# EAGLE design rgb-vfd-matrix (EAGLE 7.7.0)
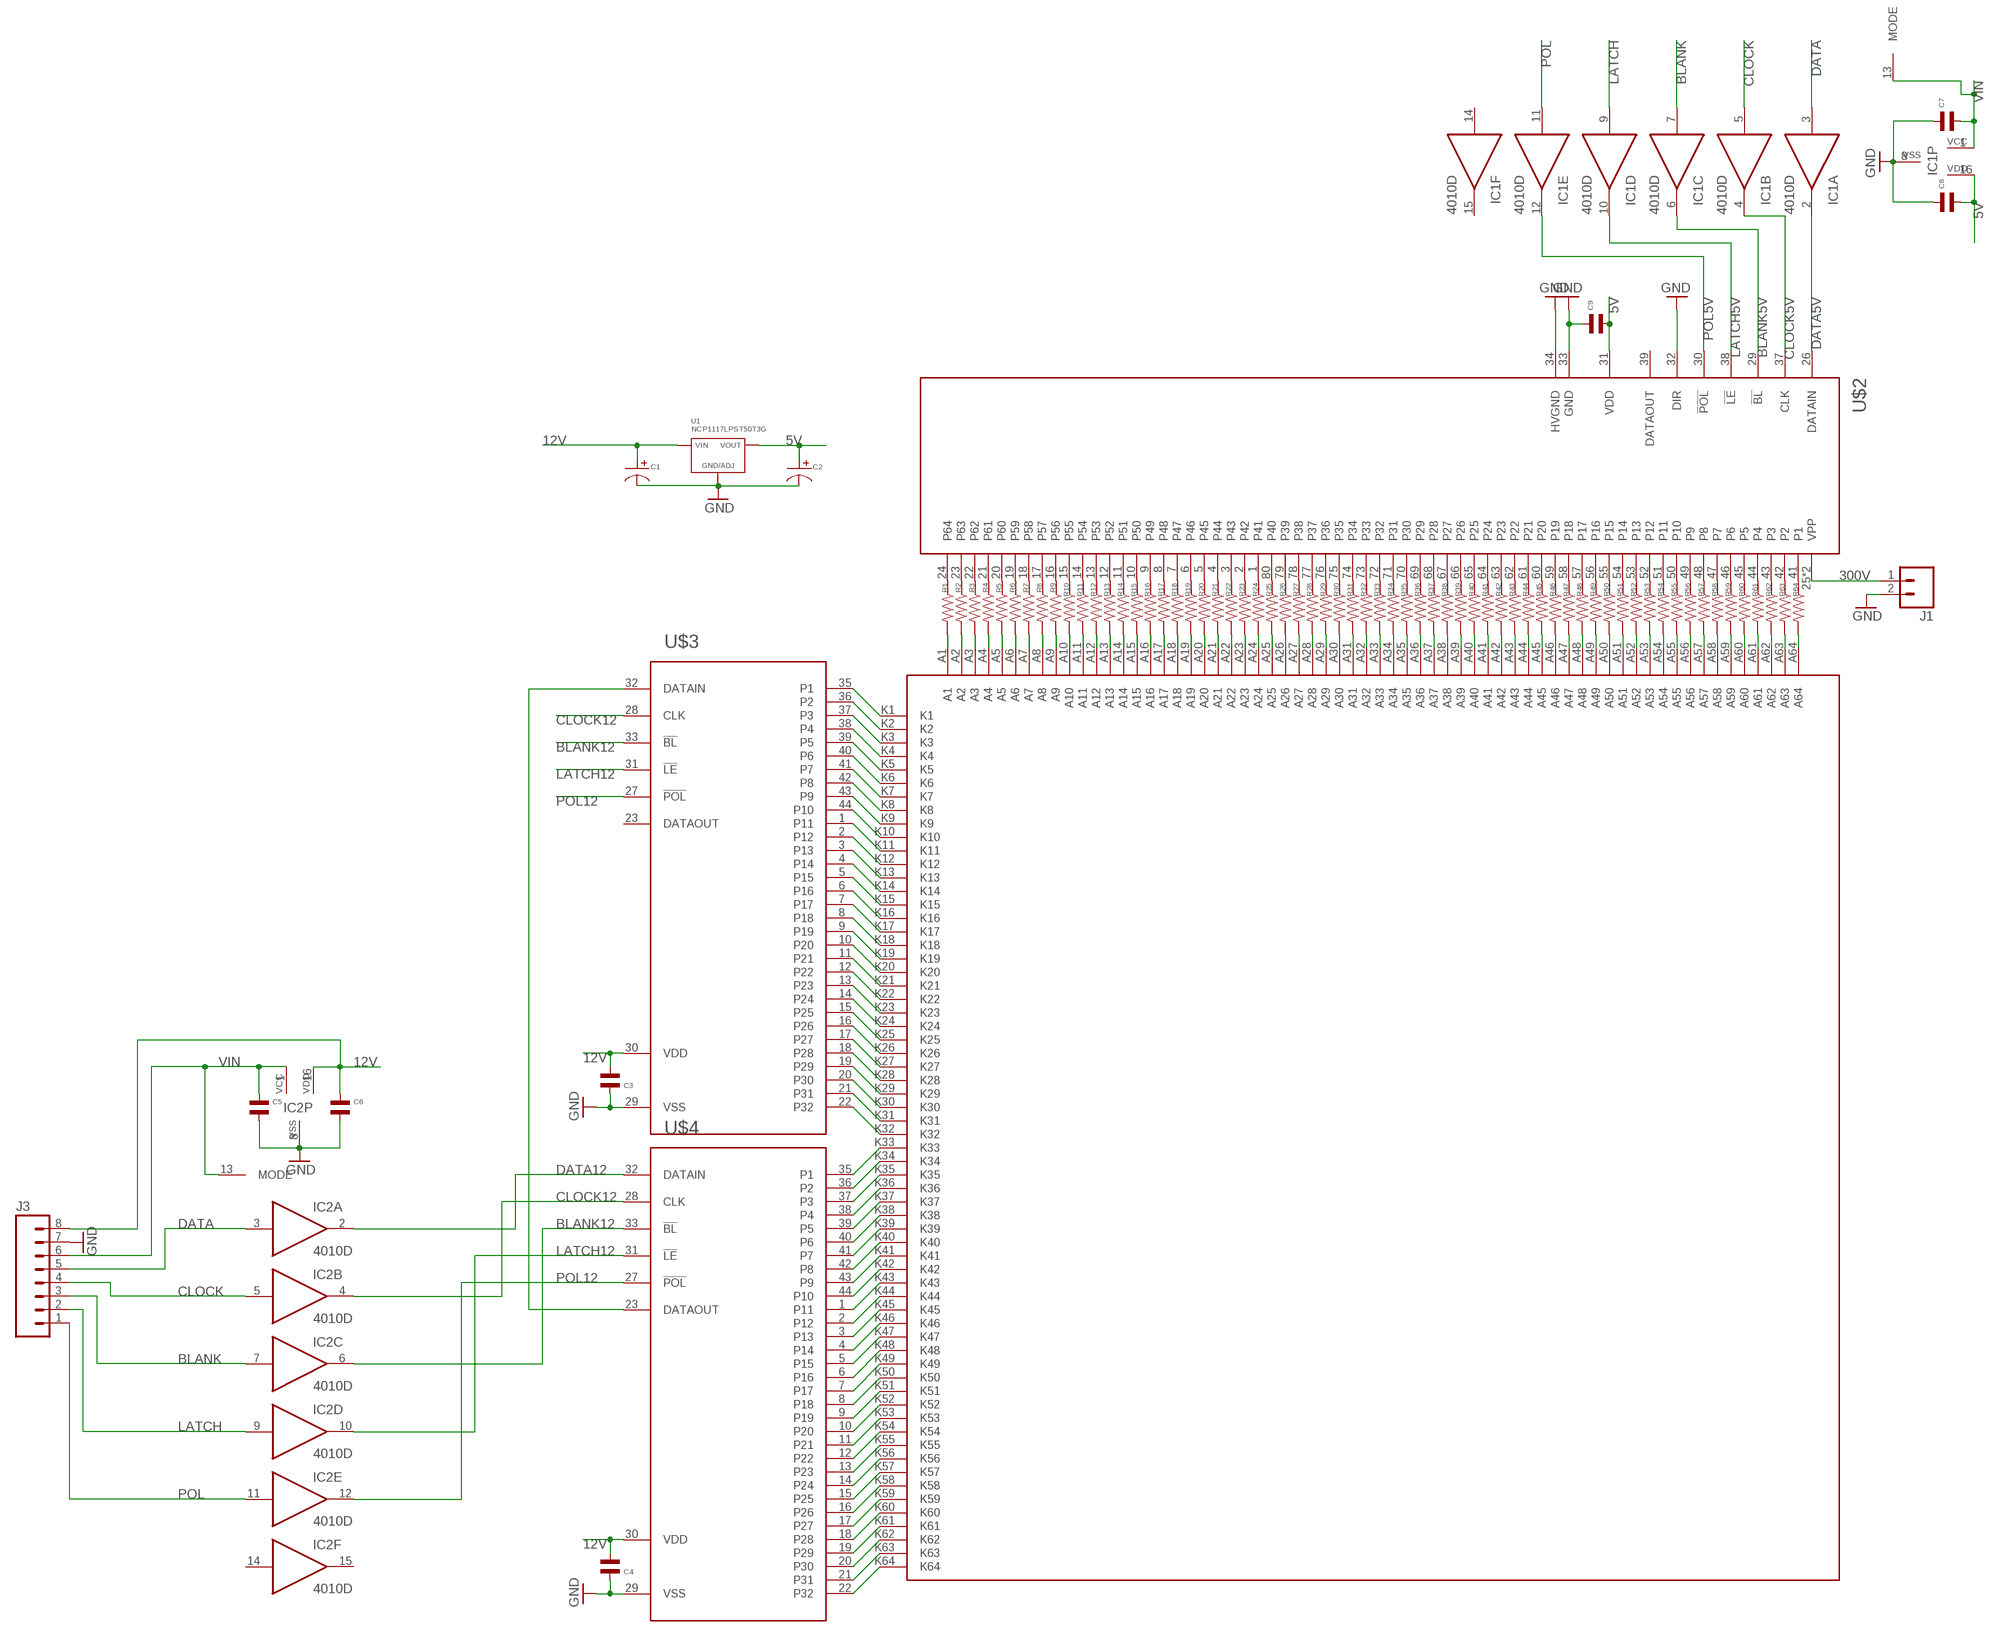
[diagram p0: schematic, sheet 1]

## Parts
C1  CAPACITOR_P_8MM  [CP8MM]
C2  CAPACITOR_P_8MM  [CP8MM]
C3  CAPACITOR_NP_0603  [C0603]
C4  CAPACITOR_NP_0603  [C0603]
C5  CAPACITOR_NP_0603  [C0603]
C6  CAPACITOR_NP_0603  [C0603]
C7  CAPACITOR_NP_0603  [C0603]
C8  CAPACITOR_NP_0603  [C0603]
C9  CAPACITOR_NP_0603  [C0603]
IC1  4010D  [SO16]
IC2  4010D  [SO16]
J1  M023.5MM  [SCREWTERMINAL-3.5MM-2]
J3  M083.5MM-8  [SCREWTERMINAL-3.5MM-8]
R1  RESISTOR_0805  [R0805]
R2  RESISTOR_0805  [R0805]
R3  RESISTOR_0805  [R0805]
R4  RESISTOR_0805  [R0805]
R5  RESISTOR_0805  [R0805]
R6  RESISTOR_0805  [R0805]
R7  RESISTOR_0805  [R0805]
R8  RESISTOR_0805  [R0805]
R9  RESISTOR_0805  [R0805]
R10  RESISTOR_0805  [R0805]
R11  RESISTOR_0805  [R0805]
R12  RESISTOR_0805  [R0805]
R13  RESISTOR_0805  [R0805]
R14  RESISTOR_0805  [R0805]
R15  RESISTOR_0805  [R0805]
R16  RESISTOR_0805  [R0805]
R17  RESISTOR_0805  [R0805]
R18  RESISTOR_0805  [R0805]
R19  RESISTOR_0805  [R0805]
R20  RESISTOR_0805  [R0805]
R21  RESISTOR_0805  [R0805]
R22  RESISTOR_0805  [R0805]
R23  RESISTOR_0805  [R0805]
R24  RESISTOR_0805  [R0805]
R25  RESISTOR_0805  [R0805]
R26  RESISTOR_0805  [R0805]
R27  RESISTOR_0805  [R0805]
R28  RESISTOR_0805  [R0805]
R29  RESISTOR_0805  [R0805]
R30  RESISTOR_0805  [R0805]
R31  RESISTOR_0805  [R0805]
R32  RESISTOR_0805  [R0805]
R33  RESISTOR_0805  [R0805]
R34  RESISTOR_0805  [R0805]
R35  RESISTOR_0805  [R0805]
R36  RESISTOR_0805  [R0805]
R37  RESISTOR_0805  [R0805]
R38  RESISTOR_0805  [R0805]
R39  RESISTOR_0805  [R0805]
R40  RESISTOR_0805  [R0805]
R41  RESISTOR_0805  [R0805]
R42  RESISTOR_0805  [R0805]
R43  RESISTOR_0805  [R0805]
R44  RESISTOR_0805  [R0805]
R45  RESISTOR_0805  [R0805]
R46  RESISTOR_0805  [R0805]
R47  RESISTOR_0805  [R0805]
R48  RESISTOR_0805  [R0805]
R49  RESISTOR_0805  [R0805]
R50  RESISTOR_0805  [R0805]
R51  RESISTOR_0805  [R0805]
R52  RESISTOR_0805  [R0805]
R53  RESISTOR_0805  [R0805]
R54  RESISTOR_0805  [R0805]
R55  RESISTOR_0805  [R0805]
R56  RESISTOR_0805  [R0805]
R57  RESISTOR_0805  [R0805]
R58  RESISTOR_0805  [R0805]
R59  RESISTOR_0805  [R0805]
R60  RESISTOR_0805  [R0805]
R61  RESISTOR_0805  [R0805]
R62  RESISTOR_0805  [R0805]
R63  RESISTOR_0805  [R0805]
R64  RESISTOR_0805  [R0805]
U1  NCP1117LPST50T3G  [SOT-223-3]
U$1  RGBVFDMATRIX  [RGBVFDMATRIX]
U$2  HV507  [PQFP80]
U$3  HV5530  [PQFP44]
U$4  HV5530  [PQFP44]

## Nets
5V: C2.P$1 C8.P$2 C9.P$2 IC1.16(P:VDD) U1.P$1(VOUT) U1.P$3(VOUT) U$2.31(VDD)
12V: C1.P$1 C3.P$2 C4.P$2 C6.P$1 IC2.16(P:VDD) J3.8 U1.P$4(VIN) U$3.30(VDD) U$4.30(VDD)
300V: J1.1 U$2.25(VPP) U$2.40(VPP)
BLANK: IC1.7(C:I) IC2.7(C:I) J3.3
BLANK5V: IC1.6(C:O) U$2.29(!BL)
BLANK12: IC2.6(C:O) U$3.33(!BL) U$4.33(!BL)
CLOCK: IC1.5(B:I) IC2.5(B:I) J3.4
CLOCK5V: IC1.4(B:O) U$2.37(CLK)
CLOCK12: IC2.4(B:O) U$3.28(CLK) U$4.28(CLK)
DATA: IC1.3(A:I) IC2.3(A:I) J3.5
DATA5V: IC1.2(A:O) U$2.26(DATAIN)
DATA12: IC2.2(A:O) U$4.32(DATAIN)
GND [gnd]: C1.P$2 C2.P$2 C3.P$1 C4.P$1 C5.P$2 C6.P$2 C7.P$1 C8.P$1 C9.P$1 IC1.8(P:VSS) IC2.8(P:VSS) J1.2 J3.7 U1.P$2(GND/ADJ) U$2.32(DIR) U$2.33(GND) U$2.34(HVGND) U$3.29(VSS) U$4.29(VSS)
LATCH: IC1.9(D:I) IC2.9(D:I) J3.2
LATCH5V: IC1.10(D:O) U$2.38(!LE)
LATCH12: IC2.10(D:O) U$3.31(!LE) U$4.31(!LE)
N$1: R1.P$2 U$1.A1
N$2: R2.P$2 U$1.A2
N$3: R3.P$2 U$1.A3
N$4: R4.P$2 U$1.A4
N$5: R5.P$2 U$1.A5
N$6: R6.P$2 U$1.A6
N$7: R7.P$2 U$1.A7
N$8: R8.P$2 U$1.A8
N$9: R9.P$2 U$1.A9
N$10: R10.P$2 U$1.A10
N$11: R11.P$2 U$1.A11
N$12: R12.P$2 U$1.A12
N$13: R13.P$2 U$1.A13
N$14: R14.P$2 U$1.A14
N$15: R15.P$2 U$1.A15
N$16: R16.P$2 U$1.A16
N$17: R17.P$2 U$1.A17
N$18: R18.P$2 U$1.A18
N$19: R19.P$2 U$1.A19
N$20: R20.P$2 U$1.A20
N$21: R21.P$2 U$1.A21
N$22: R22.P$2 U$1.A22
N$23: R23.P$2 U$1.A23
N$24: R24.P$2 U$1.A24
N$25: R25.P$2 U$1.A25
N$26: R26.P$2 U$1.A26
N$27: R27.P$2 U$1.A27
N$28: R28.P$2 U$1.A28
N$29: R29.P$2 U$1.A29
N$30: R30.P$2 U$1.A30
N$31: R31.P$2 U$1.A31
N$32: R32.P$2 U$1.A32
N$33: R33.P$2 U$1.A33
N$34: R34.P$2 U$1.A34
N$35: R35.P$2 U$1.A35
N$36: R36.P$2 U$1.A36
N$37: R37.P$2 U$1.A37
N$38: R38.P$2 U$1.A38
N$39: R39.P$2 U$1.A39
N$40: R40.P$2 U$1.A40
N$41: R41.P$2 U$1.A41
N$42: R42.P$2 U$1.A42
N$43: R43.P$2 U$1.A43
N$44: R44.P$2 U$1.A44
N$45: R45.P$2 U$1.A45
N$46: R46.P$2 U$1.A46
N$47: R47.P$2 U$1.A47
N$48: R48.P$2 U$1.A48
N$49: R49.P$2 U$1.A49
N$50: R50.P$2 U$1.A50
N$51: R51.P$2 U$1.A51
N$52: R52.P$2 U$1.A52
N$53: R53.P$2 U$1.A53
N$54: R54.P$2 U$1.A54
N$55: R55.P$2 U$1.A55
N$56: R56.P$2 U$1.A56
N$57: R57.P$2 U$1.A57
N$58: R58.P$2 U$1.A58
N$59: R59.P$2 U$1.A59
N$60: R60.P$2 U$1.A60
N$61: R61.P$2 U$1.A61
N$62: R62.P$2 U$1.A62
N$63: R63.P$2 U$1.A63
N$64: R64.P$2 U$1.A64
N$65: R1.P$1 U$2.24(P64)
N$66: U$1.K1 U$3.35(P1)
N$67: R2.P$1 U$2.23(P63)
N$68: R3.P$1 U$2.22(P62)
N$69: R4.P$1 U$2.21(P61)
N$70: R5.P$1 U$2.20(P60)
N$71: R6.P$1 U$2.19(P59)
N$72: R7.P$1 U$2.18(P58)
N$73: R8.P$1 U$2.17(P57)
N$74: R9.P$1 U$2.16(P56)
N$75: R10.P$1 U$2.15(P55)
N$76: R11.P$1 U$2.14(P54)
N$77: R12.P$1 U$2.13(P53)
N$78: R13.P$1 U$2.12(P52)
N$79: R14.P$1 U$2.11(P51)
N$80: R15.P$1 U$2.10(P50)
N$81: R16.P$1 U$2.9(P49)
N$82: R17.P$1 U$2.8(P48)
N$83: R18.P$1 U$2.7(P47)
N$84: R19.P$1 U$2.6(P46)
N$85: R20.P$1 U$2.5(P45)
N$86: R21.P$1 U$2.4(P44)
N$87: R22.P$1 U$2.3(P43)
N$88: R23.P$1 U$2.2(P42)
N$89: R24.P$1 U$2.1(P41)
N$90: R25.P$1 U$2.80(P40)
N$91: R26.P$1 U$2.79(P39)
N$92: R27.P$1 U$2.78(P38)
N$93: R28.P$1 U$2.77(P37)
N$94: R29.P$1 U$2.76(P36)
N$95: R30.P$1 U$2.75(P35)
N$96: R31.P$1 U$2.74(P34)
N$97: R32.P$1 U$2.73(P33)
N$98: R33.P$1 U$2.72(P32)
N$99: R34.P$1 U$2.71(P31)
N$100: R35.P$1 U$2.70(P30)
N$101: R36.P$1 U$2.69(P29)
N$102: R37.P$1 U$2.68(P28)
N$103: R38.P$1 U$2.67(P27)
N$104: R39.P$1 U$2.66(P26)
N$105: R40.P$1 U$2.65(P25)
N$106: R41.P$1 U$2.64(P24)
N$107: R42.P$1 U$2.63(P23)
N$108: R43.P$1 U$2.62(P22)
N$109: R44.P$1 U$2.61(P21)
N$110: R45.P$1 U$2.60(P20)
N$111: R46.P$1 U$2.59(P19)
N$112: R47.P$1 U$2.58(P18)
N$113: R48.P$1 U$2.57(P17)
N$114: R49.P$1 U$2.56(P16)
N$115: R50.P$1 U$2.55(P15)
N$116: R51.P$1 U$2.54(P14)
N$117: R52.P$1 U$2.53(P13)
N$118: R53.P$1 U$2.52(P12)
N$119: R54.P$1 U$2.51(P11)
N$120: R55.P$1 U$2.50(P10)
N$121: R56.P$1 U$2.49(P9)
N$122: R57.P$1 U$2.48(P8)
N$123: R58.P$1 U$2.47(P7)
N$124: R59.P$1 U$2.46(P6)
N$125: R60.P$1 U$2.45(P5)
N$126: R61.P$1 U$2.44(P4)
N$127: R62.P$1 U$2.43(P3)
N$128: R63.P$1 U$2.42(P2)
N$129: R64.P$1 U$2.41(P1)
N$130: U$1.K2 U$3.36(P2)
N$131: U$1.K3 U$3.37(P3)
N$132: U$1.K4 U$3.38(P4)
N$133: U$1.K5 U$3.39(P5)
N$134: U$1.K6 U$3.40(P6)
N$135: U$1.K7 U$3.41(P7)
N$136: U$1.K8 U$3.42(P8)
N$137: U$1.K9 U$3.43(P9)
N$138: U$1.K10 U$3.44(P10)
N$139: U$1.K11 U$3.1(P11)
N$140: U$1.K12 U$3.2(P12)
N$141: U$1.K13 U$3.3(P13)
N$142: U$1.K14 U$3.4(P14)
N$143: U$1.K15 U$3.5(P15)
N$144: U$1.K16 U$3.6(P16)
N$145: U$1.K17 U$3.7(P17)
N$146: U$1.K18 U$3.8(P18)
N$147: U$1.K19 U$3.9(P19)
N$148: U$1.K20 U$3.10(P20)
N$149: U$1.K21 U$3.11(P21)
N$150: U$1.K22 U$3.12(P22)
N$151: U$1.K23 U$3.13(P23)
N$152: U$1.K24 U$3.14(P24)
N$153: U$1.K25 U$3.15(P25)
N$154: U$1.K26 U$3.16(P26)
N$155: U$1.K27 U$3.17(P27)
N$156: U$1.K28 U$3.18(P28)
N$157: U$1.K29 U$3.19(P29)
N$158: U$1.K30 U$3.20(P30)
N$159: U$1.K31 U$3.21(P31)
N$160: U$1.K32 U$3.22(P32)
N$161: U$1.K33 U$4.35(P1)
N$162: U$1.K34 U$4.36(P2)
N$163: U$1.K35 U$4.37(P3)
N$164: U$1.K36 U$4.38(P4)
N$165: U$1.K37 U$4.39(P5)
N$166: U$1.K38 U$4.40(P6)
N$167: U$1.K39 U$4.41(P7)
N$168: U$1.K40 U$4.42(P8)
N$169: U$1.K41 U$4.43(P9)
N$170: U$1.K42 U$4.44(P10)
N$171: U$1.K43 U$4.1(P11)
N$172: U$1.K44 U$4.2(P12)
N$173: U$1.K45 U$4.3(P13)
N$174: U$1.K46 U$4.4(P14)
N$175: U$1.K47 U$4.5(P15)
N$176: U$1.K48 U$4.6(P16)
N$177: U$1.K49 U$4.7(P17)
N$178: U$1.K50 U$4.8(P18)
N$179: U$1.K51 U$4.9(P19)
N$180: U$1.K52 U$4.10(P20)
N$181: U$1.K53 U$4.11(P21)
N$182: U$1.K54 U$4.12(P22)
N$183: U$1.K55 U$4.13(P23)
N$184: U$1.K56 U$4.14(P24)
N$185: U$1.K57 U$4.15(P25)
N$186: U$1.K58 U$4.16(P26)
N$187: U$1.K59 U$4.17(P27)
N$188: U$1.K60 U$4.18(P28)
N$189: U$1.K61 U$4.19(P29)
N$190: U$1.K62 U$4.20(P30)
N$191: U$1.K63 U$4.21(P31)
N$192: U$3.32(DATAIN) U$4.23(DATAOUT)
N$193: U$1.K64 U$4.22(P32)
POL: IC1.11(E:I) IC2.11(E:I) J3.1
POL5V: IC1.12(E:O) U$2.30(!POL)
POL12: IC2.12(E:O) U$3.27(!POL) U$4.27(!POL)
VIN: C5.P$1 C7.P$2 IC1.1(P:VCC) IC1.13(MODE) IC2.1(P:VCC) IC2.13(MODE) J3.6
Unconnected: IC1.14(F:I) IC1.15(F:O) IC2.14(F:I) IC2.15(F:O) U$2.39(DATAOUT) U$3.23(DATAOUT)

## Library data of the parts
C1 C2 = MF_Passives:CAPACITOR_P: Library: MF_Passives Description: Device for Polarized Capacitors. Manufacture part number (MPN), Voltage Rating, and Tolerance can be added via Attributes. Check https://factory.macrofab.com/parts for the house parts list.; POPULATE: 1
C3-C9 = MF_Passives:CAPACITOR_NP: Library: MF_Passives Description: Device for Non-Polarized Capacitors. Manufacture part number (MPN) can be added via Attributes. Check https://factory.macrofab.com/parts for the house parts list.; POPULATE: 1
IC1 IC2 = 40xx:4010: Hex BUFFER, non-inverting Source: www.fairchildsemi.com CD4010.pdf © 2000 Fairchild Semiconductor Corporation DS005945
J1 = SparkFun-Connectors:M02: Standard 2-pin 0.1" header. Use with - straight break away headers ( PRT-00116) - right angle break away headers (PRT-00553) - swiss pins (PRT-00743) - machine pins (PRT-00117) - female headers (PRT-00115) Molex polarized connector foot print use with: PRT-08233 with associated crimp pins and housings. 2.54_SCREWTERM for use with PRT-10571. 3.5mm Screw Terminal footprints for PRT-08084 5mm Screw Terminal footprints for use with PRT-08432; PROD_ID: CONN-08399
J3 = SparkFun-Connectors:M08: Header 8 Standard 8-pin 0.1" header. Use with straight break away headers (SKU : PRT-00116), right angle break away headers (PRT-00553), swiss pins (PRT-00743), machine pins (PRT-00117), and female headers (PRT-00115).
R1-R64 = MF_Passives:RESISTOR: Library: MF_Passives Description: Device for Resistors. Manufacture part number (MPN), Voltage, Tolerance, and Wattage Rating can be added via Attributes. Check https://factory.macrofab.com/parts for the house parts list.; POPULATE: 1
U1 = MF_IC_Power:NCP1117LP: Manufacturer Part #: NCP1117LP Manufacturer: ON Semiconductor Description: LDO Voltage Regulators; HOUSEPART: NO; MPN: NCP1117LPST50T3G; POPULATE: 1; URL: http://www.onsemi.com/pub_link/Collateral/NCP1117LP-D.PDF
U$1 = sonik:RGBVFDMATRIX
U$2 = sonik:HV507
U$3 U$4 = sonik:HV5530

## Net classes
1 gnd: width 0.254 mm

## Board
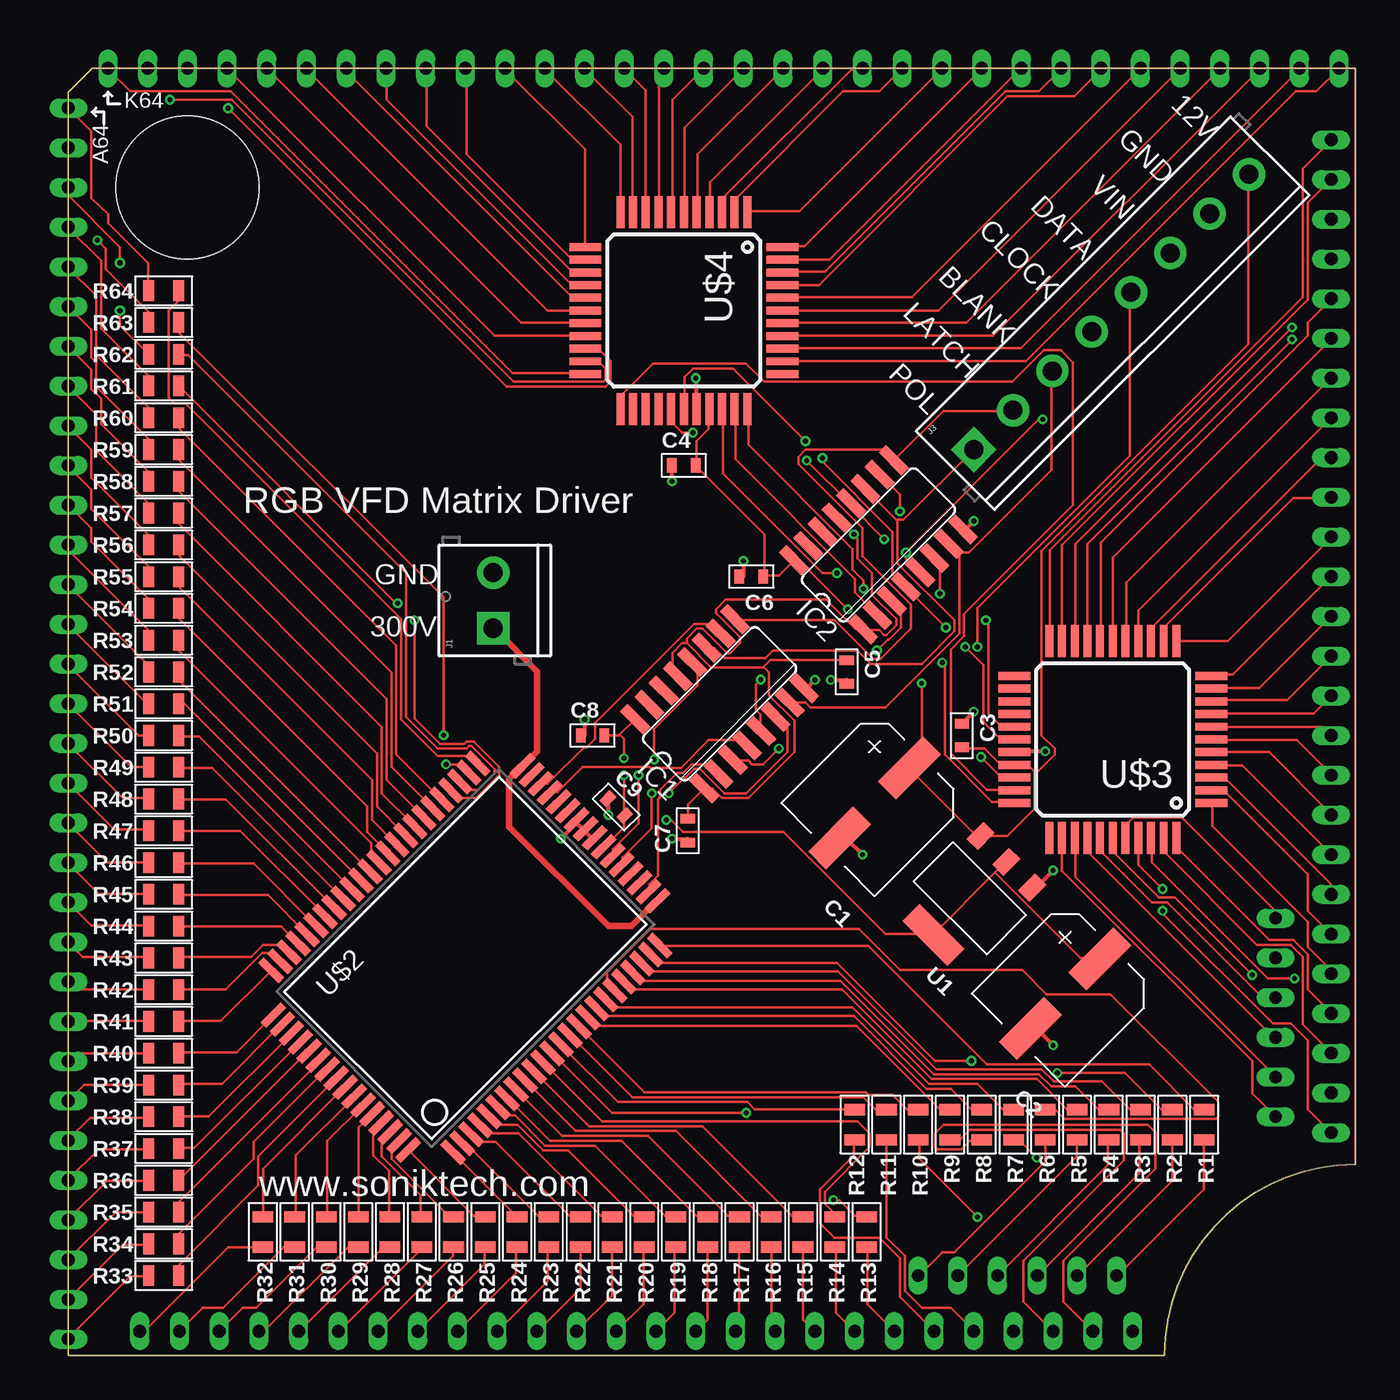
[diagram p1: board, top side]
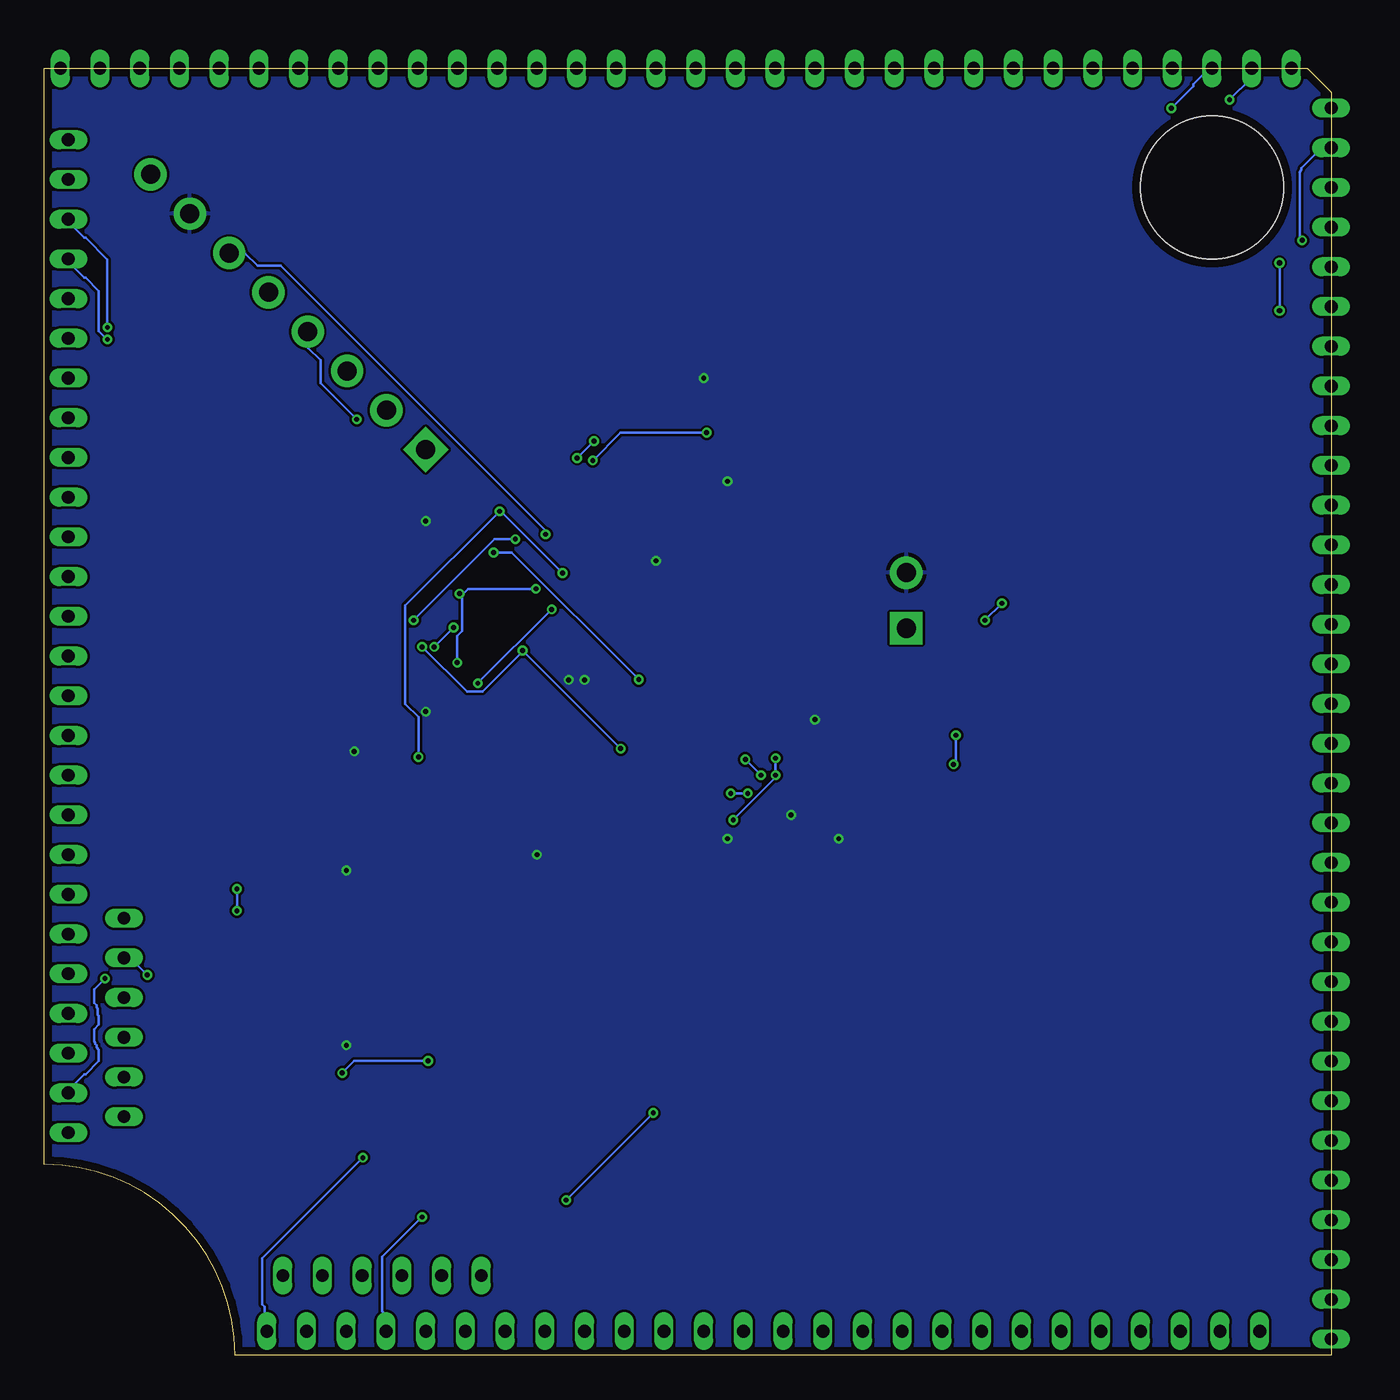
[diagram p2: board, bottom side, seen from below]

Size 81 x 81 mm. Coordinates in mm from the lower left corner, seen from the top.
Outline: 69,0 arc-90 81,12 81,81 1.5,81 0,79.5 0,0 69,0
Copper layers (1*16): Top 0.035mm / dielectric 1.5mm / Bottom 0.035mm
Design rules "MF_Standard_2_Layer_6mil": minimum track width 6mil, minimum drill 12mil, track to track 6mil, track to pad 6mil, pad to pad 5mil, via to via 6mil, smd to smd 0mil, copper to edge 20mil, drill to drill 10mil, minimum pad ring 6mil, minimum via ring 6mil, stop-mask expansion 2mil, vias tented up to drill 25mil, thermal gap 10mil

### Footprints (pad centres in the part's own frame; a part is rotated, then mirrored left to right if it is on the bottom)
CP8MM = smd 1.6 x 4: P$1 0,-3.1; P$2 0,3.1
C0603 = smd 0.6 x 0.9: P$1 -0.75,0; P$2 0.75,0
SO16 = smd 0.66 x 2.032: 1 -4.445,-3.073; 2 -3.175,-3.073; 3 -1.905,-3.073; 4 -0.635,-3.073; 5 0.635,-3.073; 6 1.905,-3.073; 7 3.175,-3.073; 8 4.445,-3.073; 9 4.445,3.073; 10 3.175,3.073; 11 1.905,3.073; 12 0.635,3.073; 13 -0.635,3.073; 14 -1.905,3.073; 15 -3.175,3.073; 16 -4.445,3.073
SCREWTERMINAL-3.5MM-2 = drill 1.2 pad 2.032 square: 1 0,0 | drill 1.2 pad 2.032: 2 3.5,0
SCREWTERMINAL-3.5MM-8 = drill 1.2 pad 2.032 square: 1 0,0 | drill 1.2 pad 2.032: 2 3.5,0; 3 7,0; 4 10.5,0; 5 14,0; 6 17.5,0; 7 21,0; 8 24.5,0
R0805 = smd 0.7 x 1.3: P$1 -0.95,0; P$2 0.95,0
SOT-223-3 = smd 1.5 x 4: P$1 3.25,0 | smd 1.5 x 1: P$2 -3.25,2.3; P$3 -3.25,0; P$4 -3.25,-2.3
RGBVFDMATRIX = drill 0.8 long: A1 66,5; A2 63.5,5; A3 61,5; A4 58.5,5; A5 56,5; A6 53.5,5; A7 67,1.5; A8 64.5,1.5; A9 62,1.5; A10 59.5,1.5; A11 57,1.5; A12 54.5,1.5; A13 52,1.5; A14 49.5,1.5; A15 47,1.5; A16 44.5,1.5; A17 42,1.5; A18 39.5,1.5; A19 37,1.5; A20 34.5,1.5; A21 32,1.5; A22 29.5,1.5; A23 27,1.5; A24 24.5,1.5; A25 22,1.5; A26 19.5,1.5; A27 17,1.5; A28 14.5,1.5; A29 12,1.5; A30 9.5,1.5; A31 7,1.5; A32 4.5,1.5; A33 0,1; A34 0,3.5; A35 0,6; A36 0,8.5; A37 0,11; A38 0,13.5; A39 0,16; A40 0,18.5; A41 0,21; A42 0,23.5; A43 0,26; A44 0,28.5; A45 0,31; A46 0,33.5; A47 0,36; A48 0,38.5; A49 0,41; A50 0,43.5; A51 0,46; A52 0,48.5; A53 0,51; A54 0,53.5; A55 0,56; A56 0,58.5; A57 0,61; A58 0,63.5; A59 0,66; A60 0,68.5; A61 0,71; A62 0,73.5; A63 0,76; A64 0,78.5; K1 76,15; K2 76,17.5; K3 76,20; K4 76,22.5; K5 76,25; K6 76,27.5; K7 79.5,14; K8 79.5,16.5; K9 79.5,19; K10 79.5,21.5; K11 79.5,24; K12 79.5,26.5; K13 79.5,29; K14 79.5,31.5; K15 79.5,34; K16 79.5,36.5; K17 79.5,39; K18 79.5,41.5; K19 79.5,44; K20 79.5,46.5; K21 79.5,49; K22 79.5,51.5; K23 79.5,54; K24 79.5,56.5; K25 79.5,59; K26 79.5,61.5; K27 79.5,64; K28 79.5,66.5; K29 79.5,69; K30 79.5,71.5; K31 79.5,74; K32 79.5,76.5; K33 80,81; K34 77.5,81; K35 75,81; K36 72.5,81; K37 70,81; K38 67.5,81; K39 65,81; K40 62.5,81; K41 60,81; K42 57.5,81; K43 55,81; K44 52.5,81; K45 50,81; K46 47.5,81; K47 45,81; K48 42.5,81; K49 40,81; K50 37.5,81; K51 35,81; K52 32.5,81; K53 30,81; K54 27.5,81; K55 25,81; K56 22.5,81; K57 20,81; K58 17.5,81; K59 15,81; K60 12.5,81; K61 10,81; K62 7.5,81; K63 5,81; K64 2.5,81 | hole 9: 7.5,73.5
PQFP80 = smd 0.5 x 1.8: 1 -9.2,-8.1; 2 -8.4,-8.1; 3 -7.6,-8.1; 4 -6.8,-8.1; 5 -6,-8.1; 6 -5.2,-8.1; 7 -4.4,-8.1; 8 -3.6,-8.1; 9 -2.8,-8.1; 10 -2,-8.1; 11 -1.2,-8.1; 12 -0.4,-8.1; 13 0.4,-8.1; 14 1.2,-8.1; 15 2,-8.1; 16 2.8,-8.1; 17 3.6,-8.1; 18 4.4,-8.1; 19 5.2,-8.1; 20 6,-8.1; 21 6.8,-8.1; 22 7.6,-8.1; 23 8.4,-8.1; 24 9.2,-8.1; 41 9.2,8.1; 42 8.4,8.1; 43 7.6,8.1; 44 6.8,8.1; 45 6,8.1; 46 5.2,8.1; 47 4.4,8.1; 48 3.6,8.1; 49 2.8,8.1; 50 2,8.1; 51 1.2,8.1; 52 0.4,8.1; 53 -0.4,8.1; 54 -1.2,8.1; 55 -2,8.1; 56 -2.8,8.1; 57 -3.6,8.1; 58 -4.4,8.1; 59 -5.2,8.1; 60 -6,8.1; 61 -6.8,8.1; 62 -7.6,8.1; 63 -8.4,8.1; 64 -9.2,8.1 | smd 1.8 x 0.5: 25 11.1,-6; 26 11.1,-5.2; 27 11.1,-4.4; 28 11.1,-3.6; 29 11.1,-2.8; 30 11.1,-2; 31 11.1,-1.2; 32 11.1,-0.4; 33 11.1,0.4; 34 11.1,1.2; 35 11.1,2; 36 11.1,2.8; 37 11.1,3.6; 38 11.1,4.4; 39 11.1,5.2; 40 11.1,6; 65 -11.1,6; 66 -11.1,5.2; 67 -11.1,4.4; 68 -11.1,3.6; 69 -11.1,2.8; 70 -11.1,2; 71 -11.1,1.2; 72 -11.1,0.4; 73 -11.1,-0.4; 74 -11.1,-1.2; 75 -11.1,-2; 76 -11.1,-2.8; 77 -11.1,-3.6; 78 -11.1,-4.4; 79 -11.1,-5.2; 80 -11.1,-6
PQFP44 = smd 2 x 0.5: 1 -6.2,4; 2 -6.2,3.2; 3 -6.2,2.4; 4 -6.2,1.6; 5 -6.2,0.8; 6 -6.2,0; 7 -6.2,-0.8; 8 -6.2,-1.6; 9 -6.2,-2.4; 10 -6.2,-3.2; 11 -6.2,-4; 23 6.2,-4; 24 6.2,-3.2; 25 6.2,-2.4; 26 6.2,-1.6; 27 6.2,-0.8; 28 6.2,0; 29 6.2,0.8; 30 6.2,1.6; 31 6.2,2.4; 32 6.2,3.2; 33 6.2,4 | smd 0.5 x 2: 12 -4,-6.2; 13 -3.2,-6.2; 14 -2.4,-6.2; 15 -1.6,-6.2; 16 -0.8,-6.2; 17 0,-6.2; 18 0.8,-6.2; 19 1.6,-6.2; 20 2.4,-6.2; 21 3.2,-6.2; 22 4,-6.2; 34 4,6.2; 35 3.2,6.2; 36 2.4,6.2; 37 1.6,6.2; 38 0.8,6.2; 39 0,6.2; 40 -0.8,6.2; 41 -1.6,6.2; 42 -2.4,6.2; 43 -3.2,6.2; 44 -4,6.2

### Placement (x,y rotation side)
C1  50.75,34.75 135 top
C2  62.75,22.75 135 top
C3  56.25,39 270 top
C4  38.75,56 0 top
C5  49,43 270 top
C6  43,49 180 top
C7  39,33 90 top
C8  33,39 0 top
C9  34.5,34.5 315 top
IC1  41,41 45 top
IC2  51,51 45 top
J1  26.75,45.75 90 top
J3  57,57 45 top
R1  71.5,14.5 270 top
R2  69.5,14.5 270 top
R3  67.5,14.5 270 top
R4  65.5,14.5 270 top
R5  63.5,14.5 270 top
R6  61.5,14.5 270 top
R7  59.5,14.5 270 top
R8  57.5,14.5 270 top
R9  55.5,14.5 270 top
R10  53.5,14.5 270 top
R11  51.5,14.5 270 top
R12  49.5,14.5 270 top
R13  50.25,7.75 270 top
R14  48.25,7.75 270 top
R15  46.25,7.75 270 top
R16  44.25,7.75 270 top
R17  42.25,7.75 270 top
R18  40.25,7.75 270 top
R19  38.25,7.75 270 top
R20  36.25,7.75 270 top
R21  34.25,7.75 270 top
R22  32.25,7.75 270 top
R23  30.25,7.75 270 top
R24  28.25,7.75 270 top
R25  26.25,7.75 270 top
R26  24.25,7.75 270 top
R27  22.25,7.75 270 top
R28  20.25,7.75 270 top
R29  18.25,7.75 270 top
R30  16.25,7.75 270 top
R31  14.25,7.75 270 top
R32  12.25,7.75 270 top
R33  6,5 180 top
R34  6,7 180 top
R35  6,9 180 top
R36  6,11 180 top
R37  6,13 180 top
R38  6,15 180 top
R39  6,17 180 top
R40  6,19 180 top
R41  6,21 180 top
R42  6,23 180 top
R43  6,25 180 top
R44  6,27 180 top
R45  6,29 180 top
R46  6,31 180 top
R47  6,33 180 top
R48  6,35 180 top
R49  6,37 180 top
R50  6,39 180 top
R51  6,41 180 top
R52  6,43 180 top
R53  6,45 180 top
R54  6,47 180 top
R55  6,49 180 top
R56  6,51 180 top
R57  6,53 180 top
R58  6,55 180 top
R59  6,57 180 top
R60  6,59 180 top
R61  6,61 180 top
R62  6,63 180 top
R63  6,65 180 top
R64  6,67 180 top
U1  56.75,28.75 225 top
U$1  0,0 0 top
U$2  25,25 45 top
U$3  65.75,38.75 180 top
U$4  38.75,65.75 270 top

### Tracks (layer width: path | path; a pad name or v marks a point on that pad's centre or on a via)
5V  (via drill 0.3)
  Top 0.152: U$2.31 33.76,32 34.98,33.22 34.98,33.91 C9.P$2 34.98,33.98 v34.98,36.5 | 34.71,39.05 35.66,40.01 IC1.16 | 34.71,39.05 34.67,39.01 33.76,39.01 C8.P$2 | v34.98,37.57 34.98,38.79 34.71,39.05 | 58.33,30.37 54.48,26.52 U1.P$1 54.41,26.52 51.44,26.52 45.03,32.92 38.71,32.92 37.95,33.68 v37.64,33.68 | 58.33,30.37 58.98,31.01 U1.P$3 | 58.33,30.37 63.7,24.99 64.92,24.99 C2.P$1
  Bottom 0.152: v34.98,37.57 v34.98,36.5 34.98,36.35 v37.64,33.68
12V  (via drill 0.3)
  Top 0.152: U$4.30 40.31,59.51 40.31,58.29 39.55,57.53 39.55,56.01 C4.P$2 39.55,55.93 43.81,51.66 43.81,49.15 C6.P$1 43.81,49.07 44.73,49.07 45.64,49.99 IC2.16 45.72,49.99 46.02,49.99 v49.07,46.94 | C3.P$2 56.31,38.18 57.68,38.18 58.67,37.19 59.51,37.19 U$3.30 59.59,37.11 60.43,37.11 60.77,36.77 | 60.77,36.77 60.81,36.73 60.81,34.37 59.13,32.69 57.45,32.69 U1.P$4 57.38,32.69 57.15,32.69 52.96,36.88 C1.P$1 52.96,36.96 53.72,37.72 v53.72,42.29 | J3.8 74.3,74.3 74.3,63.63 61.27,50.6 61.27,39.01 62.1,38.18 62.1,37.8 61.11,36.8 60.81,36.8 60.77,36.77
  Bottom 0.152: v53.72,42.29 v49.07,46.94
300V
  Top 0.152: 28.57,37.11 U$2.40 28.57,37.03 28.12,36.58 | 26.82,45.72 J1.1 | 37.03,28.57 U$2.25
  Top 0.406: 37.03,28.57 35.46,27 34,27 27.75,33.25 27.75,36.25 28.59,37.09 U$2.40 28.61,37.11 29.5,38 29.5,43.04 26.82,45.72
BLANK
  Top 0.152: IC1.7 45.49,41.07 46.41,41.07 46.71,40.77 51.44,40.77 56.08,45.41 56.08,50.44 55.47,51.05 IC2.7 56.08,50.52 56.69,50.52 61.87,55.7 61.87,61.87 J3.3
BLANK5V  (via drill 0.3)
  Top 0.152: v36.73,35.36 36.73,33.15 34.9,31.32 34.9,30.94 U$2.29 | v37.8,35.36 38.79,36.35 38.86,36.35 39.4,36.88 39.78,36.88 41.3,35.36 42.67,35.36 45.26,37.95 45.26,39.47 44.58,40.16 IC1.6
  Bottom 0.152: v37.8,35.36 v36.73,35.36
BLANK12  (via drill 0.3)
  Top 0.152: v55.02,43.59 55.17,43.43 55.17,37.8 58.14,34.82 59.51,34.82 U$3.33 | v54.86,47.93 54.86,49.84 54.56,50.14 IC2.6 | v50.06,48.23 50.06,48.77 49.38,49.45 49.38,50.75 42.82,57.3 42.82,59.51 U$4.33
  Bottom 0.152: v55.02,43.59 55.02,45.26 54.71,45.57 54.71,47.78 v54.86,47.93 54.71,47.85 54.33,48.23 v50.06,48.23
CLOCK  (via drill 0.3)
  Top 0.152: v43.59,42.52 43.28,42.22 43.28,40.62 43.59,40.31 43.59,39.32 IC1.5 | IC2.5 53.57,49.3 52.73,50.14 v52.73,50.52 61.11,58.9 v61.34,58.9
  Bottom 0.152: v43.59,42.52 51.59,50.52 v52.73,50.52 | v61.34,58.9 63.63,61.19 63.63,62.64 64.39,63.4 64.39,64.39 J3.4
CLOCK5V
  Top 0.152: U$2.37 30.33,35.43 30.79,35.43 32.38,37.03 36.58,37.03 36.65,36.96 38.56,36.96 40.31,38.71 42.37,38.71 42.67,38.41 IC1.4
CLOCK12  (via drill 0.3)
  Top 0.152: v46.41,57.53 41.83,62.1 39.32,62.1 38.79,61.57 38.79,59.59 U$4.28 | v47.47,56.46 47.47,56.24 51.89,51.82 51.89,49.15 52.65,48.39 IC2.4 52.73,48.31 v55.24,45.8 | v56.46,44.58 57.61,43.43 57.61,39.85 58.67,38.79 59.51,38.79 U$3.28
  Bottom 0.152: v47.47,56.46 v46.41,57.53 | v55.24,45.8 v56.46,44.58
DATA  (via drill 0.3)
  Top 0.152: v44.73,38.18 43.74,37.19 43.05,37.19 42.82,37.41 41.83,37.41 IC1.3 | v50.9,44.35 51.59,45.03 51.66,45.03 52.43,45.8 52.43,46.94 51.89,47.47 IC2.3 | v57.23,44.58 57.23,47.02 66.83,56.62 66.83,66.83 J3.5
  Bottom 0.152: v44.73,38.18 v50.9,44.35 50.9,44.27 53.42,41.76 54.41,41.76 v57.23,44.58
DATA5V
  Top 0.152: U$2.26 36.58,29.18 36.58,29.64 37.11,30.18 37.11,34.98 37.26,35.13 37.26,35.59 38.33,36.65 38.71,36.65 39.24,37.19 40.39,37.19 40.92,36.65 IC1.2
DATA12
  Top 0.152: U$4.32 41.99,59.51 41.99,56.39 49.53,48.84 49.53,48.01 50.9,46.63 IC2.2
GND  (via drill 0.3)
  Top 0.254: 32.5,33 32,33.5 | 32.5,33 33,32.5 U$2.32 | 32.5,33 U$2.33 | v34,34 34,35 C9.P$1 | v32.5,40 32.5,39 C8.P$1 | v38,32.5 39,32.5 C7.P$1 | v42.5,50 42.5,49 C6.P$2 | v48,42.5 49,42.5 C5.P$2 | v38,55 C4.P$1 | v57,40.5 C3.P$1 | v62,30.5 61,29.5 U1.P$2 | v61.5,38 60,38 U$3.29 | v39.5,61.5 39.5,60 U$4.29 | v47,42.5 46.5,42 IC1.8 | v57,52.5 56.5,52 IC2.8 | v31,32.5 32,33.5 | 32,33.5 U$2.34 | v62,19.5 61,20.5 C2.P$2 | v50,31.5 49,32.5 C1.P$2
  pour Bottom: 0,0 81,0 81,81 0,81
LATCH
  Top 0.152: IC1.9 41.99,46.25 48.23,46.25 50.67,43.81 51.13,43.81 53.03,45.72 53.03,47.24 49.99,50.29 49.99,52.05 45.95,56.08 45.95,56.54 46.41,57 51.36,57 51.97,56.39 IC2.9 52.05,56.39 55.09,59.44 59.44,59.44 J3.2
LATCH5V
  Top 0.152: U$2.38 29.79,35.97 30.18,35.97 32.46,38.25 32.61,38.25 33.15,38.79 33.15,39.78 39.4,46.02 40.54,46.02 41.07,45.49 IC1.10
LATCH12  (via drill 0.3)
  Top 0.152: v57.45,37.64 58.67,36.42 59.51,36.42 U$3.31 | v52.35,53.11 52.35,54.18 51.13,55.4 IC2.10 | v48.39,49.23 47.47,49.23 41.22,55.47 41.22,59.51 U$4.31
  Bottom 0.152: v57.45,37.64 57.45,40.16 58.29,41 58.29,47.17 v52.35,53.11 52.35,53.03 52.2,53.03 v48.39,49.23
N$1
  Top 0.152: R1.P$2 71.48,13.49 71.48,10.44 66.06,5.03 U$1.A1
N$2
  Top 0.152: R2.P$2 69.49,13.49 69.49,10.97 63.55,5.03 U$1.A2
N$3
  Top 0.152: R3.P$2 67.44,13.49 67.44,11.43 61.04,5.03 U$1.A3
N$4
  Top 0.152: R4.P$2 65.46,13.49 65.46,11.96 58.52,5.03 U$1.A4
N$5
  Top 0.152: R5.P$2 63.48,13.49 63.48,12.5 56.01,5.03 U$1.A5
N$6
  Top 0.152: R6.P$2 61.49,13.49 61.49,12.19 55.78,6.48 55.02,6.48 53.57,5.03 U$1.A6
N$7  (via drill 0.3)
  Top 0.152: v60.96,12.42 59.89,13.49 59.51,13.49 R7.P$2
  Bottom 0.152: v60.96,12.42 67.28,6.1 67.28,3.2 67.13,3.05 67.13,1.6 67.06,1.52 U$1.A7
N$8
  Top 0.152: R8.P$2 57.45,13.49 56.77,13.49 56.24,12.95 54.71,12.95 54.56,13.11 54.56,13.95 55.09,14.48 67.97,14.48 68.43,14.02 68.43,11.73 62.64,5.94 62.64,3.35 64.47,1.52 U$1.A8
N$9
  Top 0.152: R9.P$2 55.55,13.56 56.16,13.56 56.77,14.17 66.22,14.17 66.45,13.95 66.45,12.27 60.12,5.94 60.12,3.35 61.95,1.52 U$1.A9
N$10  (via drill 0.3)
  Top 0.152: v57.23,8.69 53.57,12.34 53.57,13.49 R10.P$2
  Bottom 0.152: v57.23,8.69 59.74,6.17 59.74,2.74 59.51,2.52 59.51,1.52 U$1.A10
N$11
  Top 0.152: R11.P$2 51.51,13.49 51.51,7.39 52.65,6.25 52.65,4.04 53.72,2.97 55.55,2.97 57,1.52 U$1.A11
N$12
  Top 0.152: R12.P$2 49.45,13.49 49.45,12.57 47.32,10.44 47.32,8.31 48.23,7.39 51.05,7.39 52.35,6.1 52.35,3.66 54.48,1.52 U$1.A12
N$13
  Top 0.152: R13.P$2 50.29,6.78 50.29,3.2 51.97,1.52 U$1.A13
N$14
  Top 0.152: R14.P$2 48.31,6.78 48.31,2.67 49.45,1.52 U$1.A14
N$15
  Top 0.152: R15.P$2 46.25,6.78 46.25,2.21 46.94,1.52 U$1.A15
N$16
  Top 0.152: R16.P$2 44.27,6.78 44.27,1.68 44.42,1.52 U$1.A16
N$17
  Top 0.152: R17.P$2 42.22,6.78 42.22,1.68 42.06,1.52 U$1.A17
N$18
  Top 0.152: R18.P$2 40.23,6.78 40.23,2.21 39.55,1.52 U$1.A18
N$19
  Top 0.152: R19.P$2 38.18,6.78 38.18,2.67 37.03,1.52 U$1.A19
N$20
  Top 0.152: R20.P$2 36.2,6.78 36.2,3.2 34.52,1.52 U$1.A20
N$21
  Top 0.152: R21.P$2 34.21,6.78 34.21,3.73 32,1.52 U$1.A21
N$22
  Top 0.152: R22.P$2 32.23,6.78 32.23,4.19 29.57,1.52 U$1.A22
N$23
  Top 0.152: R23.P$2 30.18,6.78 30.18,4.65 27.05,1.52 U$1.A23
N$24
  Top 0.152: R24.P$2 28.19,6.78 28.19,5.18 24.54,1.52 U$1.A24
N$25
  Top 0.152: R25.P$2 26.21,6.78 26.21,5.71 22.02,1.52 U$1.A25
N$26
  Top 0.152: R26.P$2 24.23,6.78 24.23,6.25 19.51,1.52 U$1.A26
N$27
  Top 0.152: R27.P$2 22.17,6.78 22.17,6.63 17.07,1.52 U$1.A27
N$28
  Top 0.152: R28.P$2 20.19,6.78 19.81,6.78 14.55,1.52 U$1.A28
N$29
  Top 0.152: R29.P$2 18.21,6.78 17.6,6.78 12.34,1.52 12.04,1.52 U$1.A29
N$30
  Top 0.152: R30.P$2 16.23,6.78 15.62,6.78 11.81,2.97 10.97,2.97 9.53,1.52 U$1.A30
N$31
  Top 0.152: R31.P$2 14.25,6.78 13.56,6.78 9.75,2.97 8.46,2.97 7.01,1.52 U$1.A31
N$32
  Top 0.152: R32.P$2 12.19,6.78 10.06,6.78 4.8,1.52 4.57,1.52 U$1.A32
N$33
  Top 0.152: R33.P$2 5.03,4.95 3.89,4.95 0,1.07 U$1.A33
N$34
  Top 0.152: R34.P$2 5.03,6.93 3.43,6.93 U$1.A34
N$35
  Top 0.152: R35.P$2 5.03,8.99 2.97,8.99 0,6.02 U$1.A35
N$36
  Top 0.152: R36.P$2 5.03,10.97 2.44,10.97 0,8.53 U$1.A36
N$37
  Top 0.152: R37.P$2 5.03,12.95 1.91,12.95 0,11.05 U$1.A37
N$38
  Top 0.152: R38.P$2 5.03,14.94 1.37,14.94 0,13.56 U$1.A38
N$39
  Top 0.152: R39.P$2 5.03,16.99 0.99,16.99 U$1.A39
N$40
  Top 0.152: R40.P$2 5.03,18.97 0.46,18.97 0,18.52 U$1.A40
N$41
  Top 0.152: R41.P$2 5.03,21.03 0,21.03 U$1.A41
N$42
  Top 0.152: R42.P$2 5.03,23.01 0.46,23.01 0,23.47 U$1.A42
N$43
  Top 0.152: R43.P$2 5.03,25.07 0.91,25.07 0,25.98 U$1.A43
N$44
  Top 0.152: R44.P$2 5.03,27.05 1.45,27.05 U$1.A44
N$45
  Top 0.152: R45.P$2 5.03,29.03 1.91,29.03 0,30.94 U$1.A45
N$46
  Top 0.152: R46.P$2 5.03,31.01 2.44,31.01 0,33.45 U$1.A46
N$47
  Top 0.152: R47.P$2 5.03,33.07 2.9,33.07 0,35.97 U$1.A47
N$48
  Top 0.152: R48.P$2 5.03,35.05 3.43,35.05 0,38.48 U$1.A48
N$49
  Top 0.152: R49.P$2 5.03,37.03 3.96,37.03 U$1.A49
N$50
  Top 0.152: R50.P$2 5.03,39.01 4.42,39.01 0,43.43 U$1.A50
N$51
  Top 0.152: R51.P$2 5.03,41.07 4.88,41.07 0,45.95 U$1.A51
N$52
  Top 0.152: R52.P$2 5.03,43.05 5.03,43.43 0,48.46 U$1.A52
N$53
  Top 0.152: U$1.A53 0,50.67 5.03,45.64 5.03,45.03 R53.P$2
N$54
  Top 0.152: R54.P$2 5.03,47.02 5.03,47.62 1.45,51.21 1.45,52.05 U$1.A54
N$55
  Top 0.152: R55.P$2 5.03,49.07 5.03,49.68 1.45,53.26 1.45,54.48 0,55.93 U$1.A55
N$56
  Top 0.152: R56.P$2 5.03,51.05 5.03,51.66 1.45,55.24 1.45,57 0,58.45 U$1.A56
N$57
  Top 0.152: R57.P$2 5.03,53.03 5.03,53.65 1.75,56.92 1.75,59.21 0,60.96 U$1.A57
N$58
  Top 0.152: R58.P$2 5.03,55.02 5.03,55.63 2.06,58.6 2.06,60.2 1.45,60.81 1.45,62.03 0,63.48 U$1.A58
N$59
  Top 0.152: R59.P$2 5.03,57.07 5.03,57.68 1.75,60.96 1.75,62.48 1.45,62.79 1.45,64.54 U$1.A59
N$60
  Top 0.152: R60.P$2 5.03,59.05 5.03,59.66 1.75,62.94 1.75,66.67 0,68.43 U$1.A60
N$61
  Top 0.152: R61.P$2 5.03,61.04 5.03,61.65 2.06,64.62 2.06,68.89 0,70.94 U$1.A61
N$62  (via drill 0.33)
  Top 0.152: U$1.A62 0,73 3.25,69.75 v3.25,68.75 | v3.25,65.75 3.25,64.8 R62.P$2
  Bottom 0.152: v3.25,68.75 v3.25,65.75
N$63  (via drill 0.3)
  Top 0.152: v1.83,70.17 2.36,69.64 2.36,68.35 5.03,65.68 5.03,65.08 R63.P$2
  Bottom 0.152: v1.83,70.17 1.98,70.32 1.98,74.47 1.88,74.62 1.88,74.7 0.61,75.97 0,75.97 U$1.A63
N$64
  Top 0.152: R64.P$2 5.03,67.06 5.03,68.73 2.5,71.25 2.5,71.81 1.45,72.81 1.45,77.04 0,78.49 U$1.A64
N$65
  Top 0.152: R1.P$1 71.48,15.47 70.87,15.47 68.05,18.29 57.84,18.29 50.37,25.76 37.26,25.76 U$2.24
N$66
  Top 0.152: U$3.35 62.56,32.54 62.56,30.48 74.52,18.52 74.52,16.46 75.97,15.01 U$1.K1
N$67  (via drill 0.3)
  Top 0.152: v62.26,17.75 66.52,17.75 68.81,15.47 69.49,15.47 R2.P$1 | v56.84,18.52 54.56,18.52 48.39,24.69 37.19,24.69 36.73,25.15 U$2.23
  Bottom 0.152: v62.26,17.75 61.49,18.52 v56.84,18.52
N$68
  Top 0.152: R3.P$1 67.44,15.47 66.83,15.47 65.08,17.22 62.03,17.22 61.27,17.98 54.63,17.98 48.46,24.16 36.58,24.16 36.12,24.61 U$2.22
N$69
  Top 0.152: R4.P$1 65.46,15.47 64.85,15.47 63.4,16.92 61.87,16.92 61.11,17.68 54.48,17.68 48.62,23.55 36.12,23.55 35.59,24.08 U$2.21
N$70
  Top 0.152: R5.P$1 63.48,15.47 62.87,15.47 60.96,17.37 54.33,17.37 48.69,23.01 35.43,23.01 34.98,23.47 U$2.20
N$71
  Top 0.152: R6.P$1 61.57,15.39 62.18,15.39 62.71,14.86 72.24,14.86 72.39,15.01 72.39,15.93 65.61,22.71 61.57,22.71 60.05,24.23 52.35,24.23 49.76,26.82 36.65,26.82 33.91,24.08 33.91,23.47 34.37,23.01 U$2.19
N$72
  Top 0.152: R7.P$1 59.44,15.47 58.83,15.47 57.23,17.07 54.18,17.07 49.38,21.87 34.37,21.87 33.91,22.33 U$2.18
N$73
  Top 0.152: R8.P$1 57.45,15.47 56.84,15.47 55.55,16.76 54.03,16.76 49.45,21.34 33.76,21.34 33.3,21.79 U$2.17
N$74
  Top 0.152: R9.P$1 55.47,15.47 54.86,15.47 49.61,20.73 33.22,20.73 32.77,21.18 U$2.16
N$75
  Top 0.152: R10.P$1 53.49,15.47 52.81,15.47 51.89,16.38 50.37,16.38 50.22,16.54 36.27,16.54 32.16,20.65 U$2.15
N$76
  Top 0.152: R11.P$1 51.44,15.47 50.83,15.47 50.06,16.23 35.51,16.23 31.62,20.12 U$2.14
N$77
  Top 0.152: R12.P$1 49.45,15.47 43.2,15.47 42.75,15.93 34.59,15.93 31.01,19.51 U$2.13
N$78  (via drill 0.3)
  Top 0.152: v48.16,9.75 48.54,9.75 49.53,8.76 50.22,8.76 R13.P$1 | v42.67,15.24 34.21,15.24 30.48,18.97 U$2.12
  Bottom 0.152: v42.67,15.24 v48.16,9.75
N$79
  Top 0.152: R14.P$1 48.23,8.76 48.23,8.91 47.62,9.53 47.62,10.29 50.44,13.11 50.44,13.95 49.68,14.71 33.6,14.71 29.95,18.36 U$2.11
N$80
  Top 0.152: R15.P$1 46.18,8.76 45.57,8.76 39.93,14.4 32.77,14.4 29.34,17.83 U$2.10
N$81
  Top 0.152: R16.P$1 44.2,8.76 43.59,8.76 38.25,14.1 31.93,14.1 28.8,17.22 U$2.9
N$82
  Top 0.152: R17.P$1 42.22,8.76 41.53,8.76 36.5,13.79 31.09,13.79 28.19,16.69 U$2.8
N$83
  Top 0.152: R18.P$1 40.23,8.76 39.55,8.76 34.82,13.49 30.33,13.49 27.66,16.15 U$2.7
N$84
  Top 0.152: R19.P$1 38.18,8.76 37.57,8.76 33.15,13.18 30.02,13.18 28.12,15.09 27.51,15.09 27.05,15.54 U$2.6
N$85
  Top 0.152: R20.P$1 36.2,8.76 35.59,8.76 31.47,12.88 29.87,12.88 28.27,14.48 27.05,14.48 26.52,15.01 U$2.5
N$86
  Top 0.152: R21.P$1 34.21,8.76 33.53,8.76 28.35,13.95 26.44,13.95 25.98,14.4 U$2.4
N$87
  Top 0.152: R22.P$1 32.23,8.76 31.55,8.76 26.9,13.41 25.83,13.41 25.38,13.87 U$2.3
N$88
  Top 0.152: R23.P$1 30.18,8.76 29.57,8.76 25.07,13.26 24.84,13.26 U$2.2
N$89
  Top 0.152: R24.P$1 28.19,8.76 24.23,12.72 U$2.1
N$90
  Top 0.152: R25.P$1 26.21,8.76 25.53,8.76 21.41,12.88 U$2.80
N$91
  Top 0.152: R26.P$1 24.23,8.76 23.93,8.76 20.34,12.34 20.34,12.95 20.8,13.41 U$2.79
N$92
  Top 0.152: R27.P$1 22.17,8.76 22.17,10.06 19.74,12.5 19.74,13.56 20.19,14.02 U$2.78
N$93
  Top 0.152: R28.P$1 20.19,8.76 20.19,11.58 19.2,12.57 19.2,14.1 19.66,14.55 U$2.77
N$94
  Top 0.152: R29.P$1 18.29,8.76 18.29,14.33 U$2.76
N$95
  Top 0.152: R30.P$1 16.31,8.76 16.31,13.49 18.52,15.7 U$2.75
N$96
  Top 0.152: R31.P$1 14.33,8.76 14.33,12.57 17.98,16.23 U$2.74
N$97
  Top 0.152: R32.P$1 12.27,8.76 12.27,11.73 17.37,16.84 U$2.73
N$98
  Top 0.152: R33.P$1 7.01,5.03 7.01,5.71 11.96,10.67 11.96,12.5 16.84,17.37 U$2.72
N$99
  Top 0.152: R34.P$1 7.01,7.01 7.01,7.7 11.66,12.34 11.66,13.41 16.23,17.98 U$2.71
N$100
  Top 0.152: R35.P$1 7.01,9.07 7.01,9.68 15.7,18.36 15.7,18.52 U$2.70
N$101
  Top 0.152: R36.P$1 7.01,11.05 15.16,19.2 U$2.69
N$102
  Top 0.152: R37.P$1 7.01,13.03 7.92,13.03 14.55,19.66 U$2.68
N$103
  Top 0.152: R38.P$1 7.01,15.01 8.84,15.01 14.02,20.19 U$2.67
N$104
  Top 0.152: R39.P$1 7.01,17.07 9.68,17.07 13.41,20.8 U$2.66
N$105
  Top 0.152: R40.P$1 7.01,19.05 10.59,19.05 12.88,21.34 U$2.65
N$106
  Top 0.152: R41.P$1 7.01,21.03 9.6,21.03 12.72,24.16 U$2.64
N$107
  Top 0.152: R42.P$1 7.01,23.01 9.91,23.01 12.19,25.3 12.8,25.3 13.26,24.84 U$2.63
N$108
  Top 0.152: R43.P$1 7.01,25.07 11.51,25.07 12.27,25.83 13.41,25.83 13.87,25.38 U$2.62
N$109
  Top 0.152: R44.P$1 7.01,26.98 13.41,26.98 14.4,25.98 U$2.61
N$110
  Top 0.152: R45.P$1 7.01,28.96 12.57,28.96 15.01,26.52 U$2.60
N$111
  Top 0.152: R46.P$1 7.01,30.94 11.66,30.94 15.54,27.05 U$2.59
N$112
  Top 0.152: R47.P$1 7.01,32.99 10.82,32.99 16.15,27.66 U$2.58
N$113
  Top 0.152: R48.P$1 7.01,34.98 9.91,34.98 16.69,28.19 U$2.57
N$114
  Top 0.152: R49.P$1 7.01,36.96 9.07,36.96 17.22,28.8 U$2.56
N$115
  Top 0.152: R50.P$1 7.01,38.94 8.23,38.94 17.83,29.34 U$2.55
N$116
  Top 0.152: R51.P$1 7.01,41 7.32,41 18.36,29.95 U$2.54
N$117
  Top 0.152: R52.P$1 7.01,42.98 7.01,42.44 18.97,30.48 U$2.53
N$118
  Top 0.152: R53.P$1 7.01,44.96 7.01,44.27 19.05,32.23 19.05,31.47 19.51,31.01 U$2.52
N$119
  Top 0.152: R54.P$1 7.01,46.94 7.01,46.33 18.82,34.52 18.82,32.92 20.12,31.62 U$2.51
N$120
  Top 0.152: R55.P$1 7.01,49 7.01,48.31 19.13,36.2 19.13,33.68 20.65,32.16 U$2.50
N$121
  Top 0.152: R56.P$1 7.01,50.98 7.01,50.29 19.43,37.87 19.43,34.52 21.18,32.77 U$2.49
N$122
  Top 0.152: R57.P$1 7.01,52.96 7.01,52.27 19.74,39.55 19.74,35.36 21.79,33.3 U$2.48
N$123
  Top 0.152: R58.P$1 7.01,54.94 7.01,54.33 20.04,41.3 20.04,36.2 22.33,33.91 U$2.47
N$124
  Top 0.152: R59.P$1 7.01,57 7.01,56.31 20.34,42.98 20.34,37.03 22.94,34.44 U$2.46
N$125
  Top 0.152: R60.P$1 7.01,58.98 7.01,58.29 20.65,44.65 20.65,37.8 23.47,34.98 U$2.45
N$126  (via drill 0.3)
  Top 0.152: v20.73,47.32 20.65,47.32 7.01,60.96 R61.P$1 | v21.79,46.25 21.79,40.08 23.39,38.48 24.92,38.48 25.07,38.63 25.53,38.63 27.13,37.03 27.13,36.5 25.68,35.05 24.61,35.05 24.16,35.51 U$2.44
  Bottom 0.152: v21.79,46.25 v20.73,47.32
N$127
  Top 0.152: R62.P$1 7.01,62.94 7.54,62.94 21.26,49.23 21.26,40.16 23.24,38.18 25.07,38.18 25.22,38.33 25.38,38.33 26.82,36.88 26.82,36.65 25.76,35.59 25.15,35.59 24.69,36.04 U$2.43
N$128  (via drill 0.3)
  Top 0.152: v23.62,39.01 23.62,47.7 7.01,64.31 7.01,65 R63.P$1 | v23.77,37.19 24.69,37.19 25.15,36.73 U$2.42
  Bottom 0.152: v23.62,39.01 23.62,37.34 v23.77,37.19
N$129
  Top 0.152: R64.P$1 6.93,66.98 6.93,66.37 6.33,65.76 6.33,60.27 6.71,59.89 7.39,59.89 20.95,46.33 20.95,40.01 23.24,37.72 25.3,37.72 25.76,37.26 U$2.41
N$130
  Top 0.152: U$3.36 63.4,32.54 63.4,30.1 75.97,17.53 U$1.K2
N$131
  Top 0.152: U$3.37 64.16,32.54 64.16,31.7 75.82,20.04 75.97,20.04 U$1.K3
N$132
  Top 0.152: U$3.38 65,32.54 65,31.7 68.2,28.5 69.19,28.5 75.13,22.55 75.97,22.55 U$1.K4
N$133  (via drill 0.3)
  Top 0.152: v74.52,23.93 69.65,28.8 68.66,28.8 65.76,31.7 65.76,32.54 U$3.39
  Bottom 0.152: v74.52,23.93 75.59,24.99 75.97,24.99 U$1.K5
N$134
  Top 0.152: U$3.40 66.6,32.61 66.6,33.38 67.06,33.83 70.1,33.83 75.97,27.96 75.97,27.51 U$1.K6
N$135  (via drill 0.3)
  Top 0.152: v68.89,29.34 67.36,30.86 67.36,32.54 U$3.41 | v68.89,27.96 68.89,27.81 75.82,20.88 76.96,20.88 78.03,19.81 78.03,15.47 79.48,14.02 U$1.K7
  Bottom 0.152: v68.89,27.96 v68.89,29.34
N$136  (via drill 0.3)
  Top 0.152: v77.19,23.7 75.51,23.7 68.2,31.01 68.2,32.54 U$3.42
  Bottom 0.152: v77.19,23.7 77.88,23.01 77.88,22.17 77.72,22.02 77.72,21.87 77.65,21.79 77.65,21.41 77.57,21.34 77.57,20.8 77.88,20.5 77.88,19.74 77.8,19.66 77.8,19.58 77.72,19.51 77.72,19.36 77.57,19.2 77.57,18.52 78.41,17.68 78.49,17.68 79.48,16.69 79.48,16.54 U$1.K8
N$137
  Top 0.152: U$3.43 68.96,32.54 68.96,31.7 74.83,25.83 76.96,25.83 77.72,25.07 77.72,20.8 79.48,19.05 U$1.K9
N$138
  Top 0.152: U$3.44 69.8,32.54 69.8,31.93 75.59,26.14 77.11,26.14 78.03,25.22 78.03,23.01 79.48,21.57 U$1.K10
N$139
  Top 0.152: U$3.1 72.01,34.75 72.01,33.3 78.03,27.28 78.03,25.68 79.48,24.23 79.48,24 U$1.K11
N$140
  Top 0.152: U$3.2 72.01,35.51 72.77,35.51 78.03,30.25 78.03,27.96 79.48,26.52 U$1.K12
N$141
  Top 0.152: U$3.3 72.01,36.35 72.77,36.35 79.48,29.64 79.48,29.03 U$1.K13
N$142
  Top 0.152: U$3.4 72.01,37.11 73.91,37.11 79.48,31.55 U$1.K14
N$143
  Top 0.152: U$3.5 72.01,37.95 75.59,37.95 79.48,34.06 U$1.K15
N$144
  Top 0.152: U$3.6 72.01,38.71 77.34,38.71 79.48,36.58 U$1.K16
N$145
  Top 0.152: U$3.7 72.01,39.55 78.94,39.55 79.48,39.01 U$1.K17
N$146
  Top 0.152: U$3.8 72.01,40.39 78.41,40.39 79.48,41.45 U$1.K18
N$147
  Top 0.152: U$3.9 72.01,41.22 76.73,41.22 79.48,43.97 U$1.K19
N$148
  Top 0.152: U$3.10 72.01,41.99 74.98,41.99 79.48,46.48 U$1.K20
N$149
  Top 0.152: U$3.11 72.01,42.82 73.3,42.82 79.48,49 U$1.K21
N$150
  Top 0.152: U$3.12 69.8,44.96 73,44.96 79.48,51.44 U$1.K22
N$151
  Top 0.152: U$3.13 68.96,45.8 77.11,53.95 79.48,53.95 U$1.K23
N$152
  Top 0.152: U$3.14 68.2,44.96 68.2,45.8 78.87,56.46 79.48,56.46 U$1.K24
N$153
  Top 0.152: U$3.15 67.36,44.96 67.36,46.86 79.48,58.98 U$1.K25
N$154
  Top 0.152: U$3.16 66.6,44.96 66.6,48.62 79.48,61.49 U$1.K26
N$155
  Top 0.152: U$3.17 65.76,50.22 79.48,63.93 U$1.K27
N$156
  Top 0.152: U$3.18 65,44.96 65,51.13 78.03,64.16 78.03,65 79.48,66.45 U$1.K28
N$157  (via drill 0.3)
  Top 0.152: v77.04,63.93 64.16,51.05 U$3.19
  Bottom 0.152: v77.04,63.93 77.57,64.47 77.57,66.98 78.41,67.82 78.49,67.82 79.48,68.81 79.48,68.96 U$1.K29
N$158  (via drill 0.3)
  Top 0.152: v77.04,64.69 63.4,51.05 63.4,44.96 U$3.20
  Bottom 0.152: v77.04,64.69 77.04,68.96 78.41,70.33 78.49,70.33 79.48,71.32 79.48,71.48 U$1.K30
N$159
  Top 0.152: U$3.21 62.56,50.98 78.03,66.45 78.03,72.54 79.48,73.99 U$1.K31
N$160
  Top 0.152: U$3.22 61.8,44.96 61.8,50.67 77.72,66.6 77.72,74.68 79.48,76.43 U$1.K32
N$161
  Top 0.152: U$4.35 60.27,62.56 77.27,79.55 78.56,79.55 79.93,80.92 U$1.K33
N$162
  Top 0.152: U$4.36 44.96,63.4 59.97,63.4 77.5,80.92 U$1.K34
N$163
  Top 0.152: U$4.37 58.22,64.16 74.98,80.92 U$1.K35
N$164
  Top 0.152: U$4.38 44.96,65 56.54,65 72.47,80.92 U$1.K36
N$165
  Top 0.152: U$4.39 54.79,65.76 69.95,80.92 U$1.K37
N$166
  Top 0.152: U$4.40 44.96,66.6 53.11,66.6 67.44,80.92 U$1.K38
N$167
  Top 0.152: U$4.41 44.96,67.36 47.24,67.36 59.13,79.25 63.32,79.25 65,80.92 U$1.K39
N$168
  Top 0.152: U$4.42 44.96,68.2 47.62,68.2 58.98,79.55 61.11,79.55 62.48,80.92 U$1.K40
N$169
  Top 0.152: U$4.43 47.93,68.96 59.97,81 U$1.K41
N$170
  Top 0.152: U$4.44 44.96,69.8 46.33,69.8 57.45,80.92 U$1.K42
N$171
  Top 0.152: U$4.1 42.82,72.01 46.02,72.01 54.94,80.92 U$1.K43
N$172
  Top 0.152: U$4.2 41.99,72.01 41.99,72.77 48.77,79.55 51.05,79.55 52.43,80.92 U$1.K44
N$173
  Top 0.152: U$4.3 41.22,72.01 41.22,72.85 49.3,80.92 49.99,80.92 U$1.K45
N$174
  Top 0.152: U$4.4 40.39,72.01 40.39,73.84 47.47,80.92 U$1.K46
N$175
  Top 0.152: U$4.5 39.62,72.01 39.62,75.59 44.96,80.92 U$1.K47
N$176
  Top 0.152: U$4.6 38.79,72.01 38.79,77.27 42.44,80.92 U$1.K48
N$177
  Top 0.152: U$4.7 38.02,72.01 38.02,79.02 39.93,80.92 U$1.K49
N$178
  Top 0.152: U$4.8 37.19,72.01 37.19,80.62 37.49,80.92 U$1.K50
N$179
  Top 0.152: U$4.9 36.35,72.01 36.35,79.63 35.05,80.92 U$1.K51
N$180
  Top 0.152: U$4.10 35.51,72.01 35.51,77.95 32.54,80.92 U$1.K52
N$181
  Top 0.152: U$4.11 34.75,72.01 34.75,76.2 30.02,80.92 U$1.K53
N$182
  Top 0.152: U$4.12 32.54,69.8 32.54,75.89 27.51,80.92 U$1.K54
N$183
  Top 0.152: U$4.13 32.54,68.96 31.7,68.96 25.07,75.59 25.07,80.92 U$1.K55
N$184
  Top 0.152: U$4.14 32.54,68.2 31.7,68.2 22.55,77.34 22.55,80.92 U$1.K56
N$185
  Top 0.152: U$4.15 32.54,67.36 31.7,67.36 20.04,79.02 20.04,80.92 U$1.K57
N$186
  Top 0.152: U$4.16 32.54,66.6 31.7,66.6 17.53,80.77 17.53,80.92 U$1.K58
N$187
  Top 0.152: U$4.17 32.54,65.76 30.18,65.76 15.01,80.92 U$1.K59
N$188
  Top 0.152: U$4.18 32.54,65 28.5,65 12.57,80.92 U$1.K60
N$189
  Top 0.152: U$4.19 32.54,64.16 26.82,64.16 10.06,80.92 U$1.K61
N$190  (via drill 0.3)
  Top 0.152: v10.06,78.49 27.58,60.96 33.83,60.96 34.14,61.27 34.14,62.56 33.38,63.32 32.61,63.32 U$4.20
  Bottom 0.152: v10.06,78.49 8.69,79.86 8.69,80.01 7.77,80.92 7.54,80.92 U$1.K62
N$191  (via drill 0.3)
  Top 0.152: v6.4,79.02 10.29,79.02 28.04,61.27 33.68,61.27 33.83,61.42 33.83,62.1 33.45,62.48 32.61,62.48 U$4.21
  Bottom 0.152: v6.4,79.02 5.03,80.39 5.03,80.92 U$1.K63
N$192
  Top 0.152: U$4.23 34.82,59.59 34.82,60.43 36.8,62.41 42.67,62.41 43.81,61.27 59.44,61.27 61.42,63.25 62.48,63.25 63.25,62.48 63.25,53.49 56.39,46.63 56.39,45.26 55.55,44.42 55.55,37.87 57.84,35.59 59.51,35.59 U$3.32
N$193
  Top 0.152: U$4.22 32.54,61.8 27.96,61.8 10.21,79.55 3.89,79.55 2.52,80.92 U$1.K64
POL
  Top 0.152: 52.16,52.54 50.22,54.48 IC2.11 | 52.16,52.54 52.2,52.5 52.2,49.84 55.78,46.25 55.78,45.57 53.72,43.51 50.52,43.51 49.68,44.35 44.35,44.35 43.89,43.89 41.3,43.89 40.69,44.5 40.23,44.5 IC1.11 | J3.1 52.58,52.58 52.2,52.58 52.16,52.54
POL5V  (via drill 0.3)
  Top 0.152: v35.89,36.5 35.89,33.45 34.29,31.85 34.29,31.47 U$2.30 | v36.88,37.49 36.88,39.4 39.62,42.14 39.62,43.28 39.32,43.59 IC1.12
  Bottom 0.152: v36.88,37.49 v35.89,36.5
POL12  (via drill 0.3)
  Top 0.152: v39.32,58.06 38.63,58.06 38.02,58.67 38.02,59.51 U$4.27 | v46.48,56.31 49.23,53.57 IC2.12 49.23,53.49 v51.36,51.36 | v57.76,46.25 57.91,46.1 57.91,40.39 58.67,39.62 59.51,39.62 U$3.27
  Bottom 0.152: v39.32,58.06 44.73,58.06 v46.48,56.31 | v57.76,46.25 52.65,51.36 v51.36,51.36
VIN  (via drill 0.3)
  Top 0.152: C7.P$2 39.01,33.76 39.01,34.67 40.01,35.66 IC1.1 40.08,35.66 40.54,35.66 41.15,35.05 42.82,35.05 45.72,37.95 45.72,39.93 44.12,41.53 44.12,42.98 43.78,43.32 | 43.78,43.32 43.74,43.28 40.46,43.28 38.94,44.81 | 43.78,43.32 44.2,43.74 49,43.74 C5.P$1 | 38.94,44.81 38.63,44.81 38.02,44.2 38.02,43.05 38.33,42.75 IC1.13 | 49.42,51.63 48.39,52.65 IC2.13 | 49.42,51.63 49.68,51.36 49.68,50.14 50.6,49.23 50.6,47.85 52.12,46.33 52.12,45.95 51.51,45.34 51.36,45.34 51.05,45.64 50.06,45.64 IC2.1 49.99,45.72 49.53,45.72 47.7,47.55 41.38,47.55 40.77,46.94 40.77,46.71 42.29,45.19 42.29,44.81 41.68,44.2 41.45,44.2 39.93,45.72 39.55,45.72 38.94,45.11 38.94,44.81 | v49.45,51.66 49.42,51.63
  Bottom 0.152: v49.45,51.66 49.45,51.89 66.14,68.58 67.59,68.58 68.35,69.34 69.34,69.34 J3.6

### Text on the board
tNames: A64 | K64 | 12V | GND | VIN | DATA | CLOCK | BLANK | LATCH | POL | RGB VFD Matrix Driver | GND | 300V | www.soniktech.com